# EAGLE design ArduinoProMiniLEDdriver (EAGLE 8.2.1)
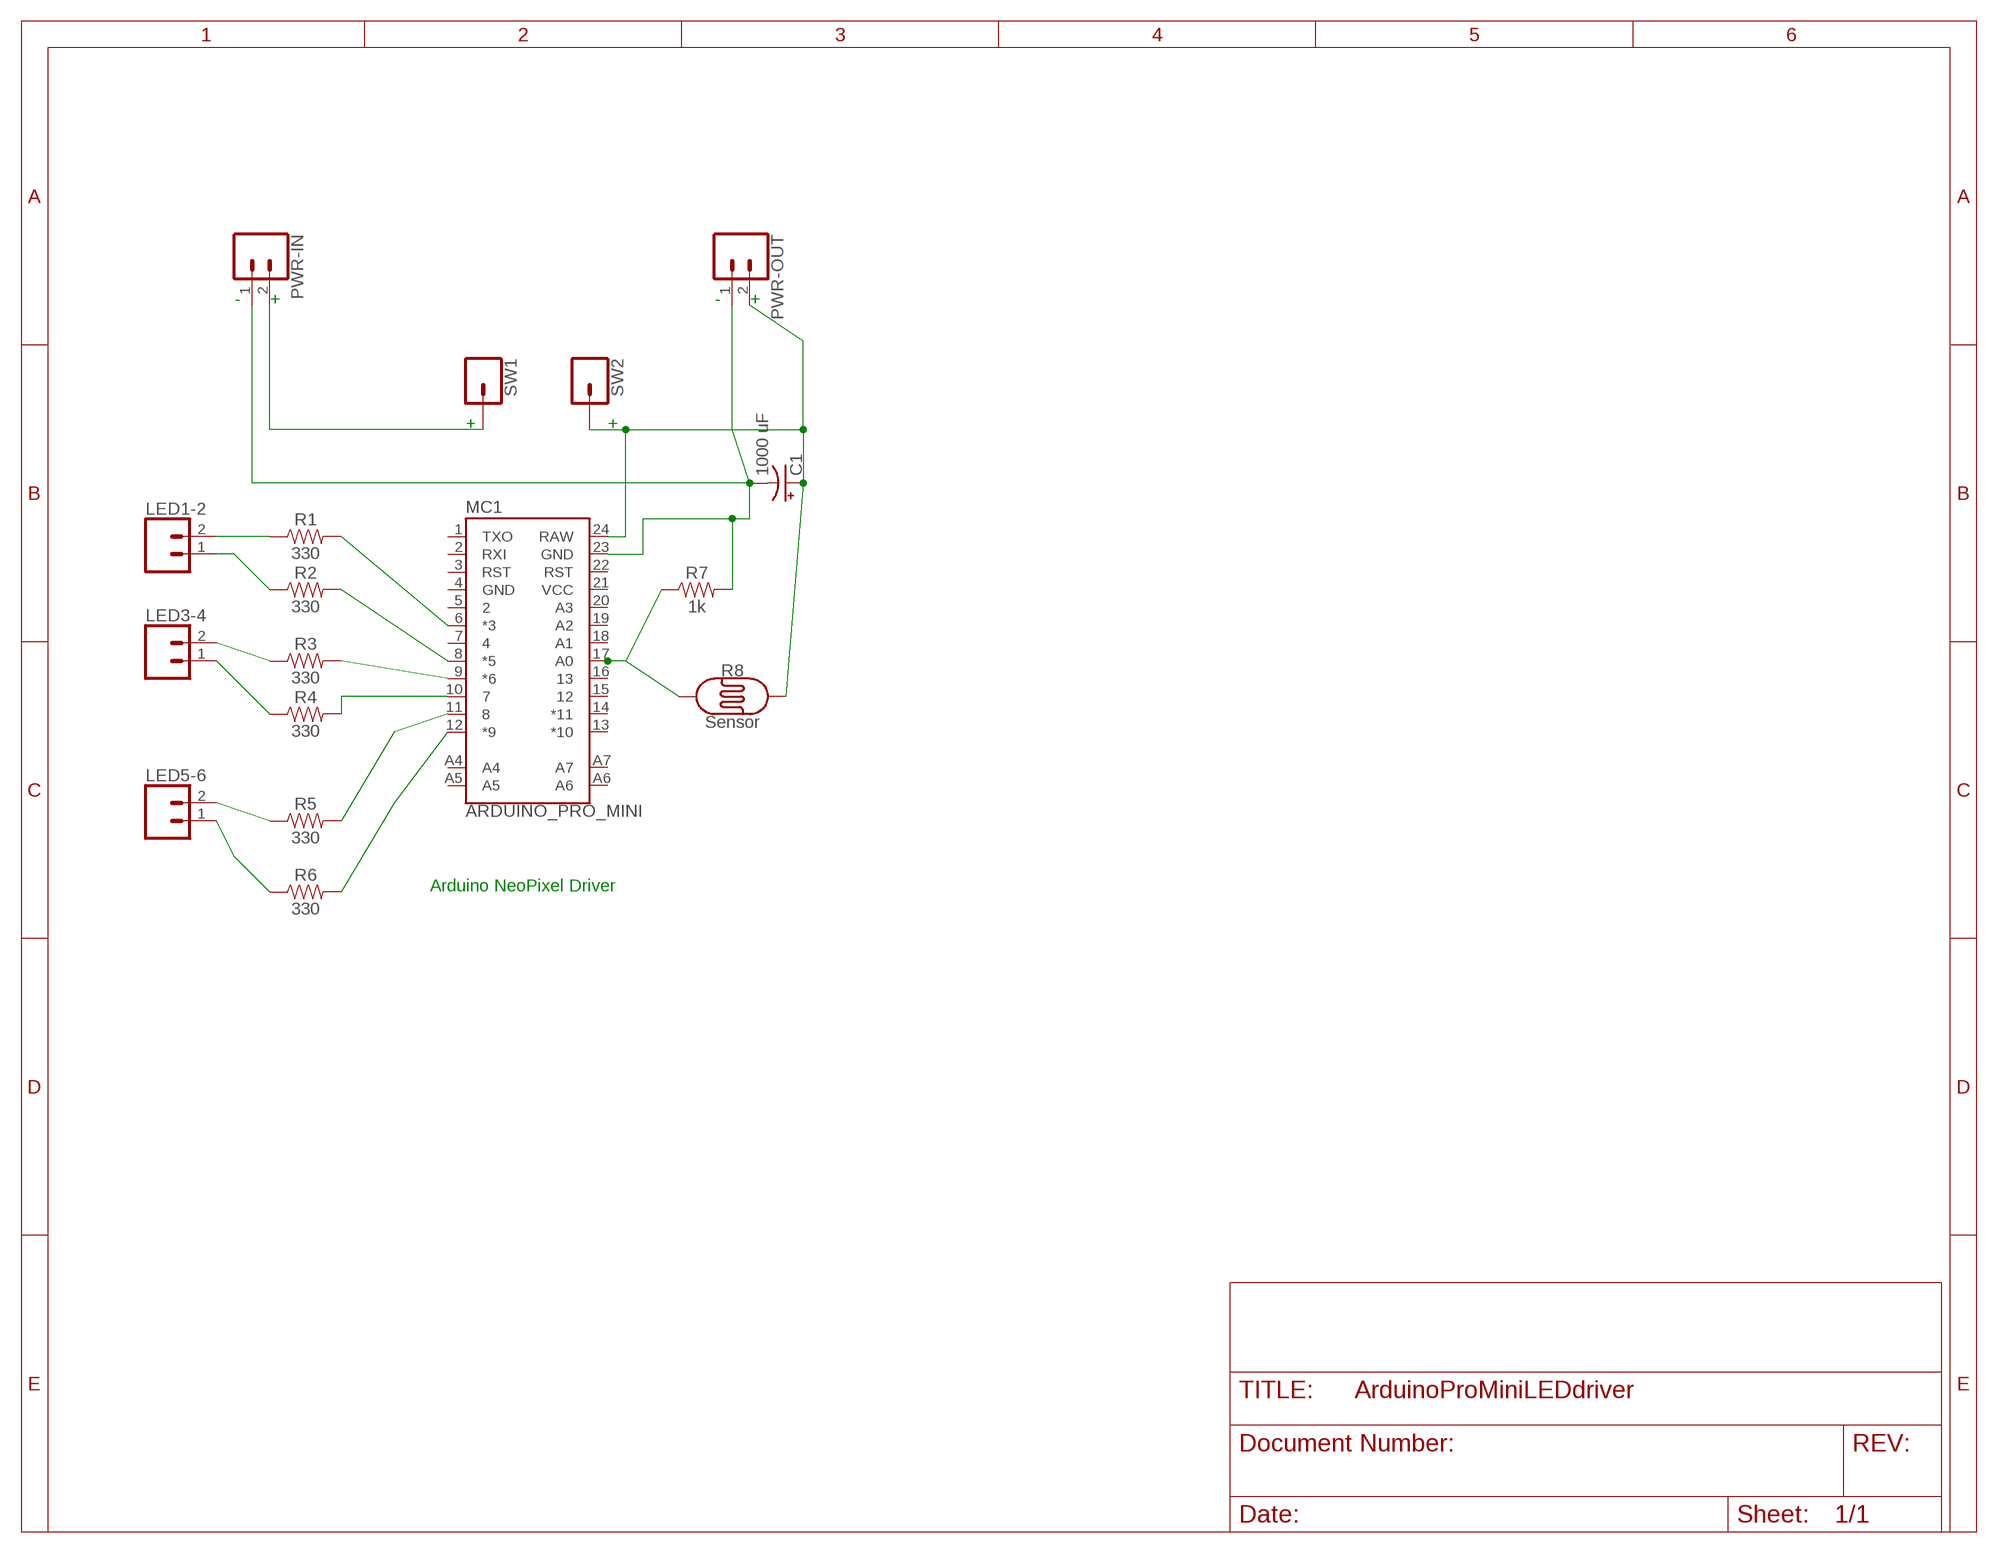
[diagram p0: schematic, sheet 1]

## Parts
C1  1000 uF  1000UF-RADIAL-5MM-25V-20%  [CPOL-RADIAL-5MM-10MM]
LED1-2  CONN_025MM  [SCREWTERMINAL-5MM-2]
LED3-4  CONN_025MM  [SCREWTERMINAL-5MM-2]
LED5-6  CONN_025MM  [SCREWTERMINAL-5MM-2]
MC1  ARDUINO_PRO_MINI  [ARDUINO_PRO_MINI]
PWR-IN  CONN_025MM  [SCREWTERMINAL-5MM-2]
PWR-OUT  CONN_025MM  [SCREWTERMINAL-5MM-2]
R1  330  330OHM-HORIZ-1/10W-5%  [AXIAL-0.3]
R2  330  330OHM-HORIZ-1/10W-5%  [AXIAL-0.3]
R3  330  330OHM-HORIZ-1/10W-5%  [AXIAL-0.3]
R4  330  330OHM-HORIZ-1/10W-5%  [AXIAL-0.3]
R5  330  330OHM-HORIZ-1/10W-5%  [AXIAL-0.3]
R6  330  330OHM-HORIZ-1/10W-5%  [AXIAL-0.3]
R7  1k  1KOHM-HORIZ-1/4W-1%  [AXIAL-0.3]
R8  Sensor  PHOTOCELLPTH  [PHOTOCELL]
SW1  CONN_01  [1X01]
SW2  CONN_01  [1X01]

## Nets
GND [Power]: C1.- MC1.23(GND) PWR-IN.1 PWR-OUT.1 R7.P$2
N$1: MC1.6(*3) R1.P$2
N$2: MC1.8(*5) R2.P$2
N$3: MC1.9(*6) R3.P$2
N$4: MC1.10 R4.P$2
N$5: LED1-2.2 R1.P$1
N$6: LED1-2.1 R2.P$1
N$7: LED3-4.2 R3.P$1
N$8: LED3-4.1 R4.P$1
N$9: LED5-6.2 R5.P$1
N$10: LED5-6.1 R6.P$1
N$11 [Power]: C1.+ MC1.24(RAW) PWR-OUT.2 R8.2 SW2.1
N$13 [Power]: PWR-IN.2 SW1.1
N$14: MC1.17(A0) R7.P$1 R8.1
N$15: MC1.11 R5.P$2
N$16: MC1.12(*9) R6.P$2
Unconnected: MC1.1(TXO) MC1.2(RXI) MC1.3(RST) MC1.5 MC1.7 MC1.13(*10) MC1.14(*11) MC1.15 MC1.16 MC1.18(A1) MC1.19(A2) MC1.20(A3) MC1.22(RST) MC1.A4 MC1.A5 MC1.A6 MC1.A7

## Notes on the sheet
- - | + | - | +
- + | +
- Arduino NeoPixel Driver

## Power pins joined to a net without a drawn wire
GND: MC1.4(GND)
VCC: MC1.21(VCC)

## Library data of the parts
C1 = SparkFun-Capacitors:1000UF: 1,000µF/1mF ceramic capacitors A capacitor is a passive two-terminal electrical component used to store electrical energy temporarily in an electric field. CAP-08070; PROD_ID: CAP-09538; VALUE: 1mF
LED1-2 LED3-4 LED5-6 PWR-IN PWR-OUT = SparkFun-Connectors:CONN_02: Multi connection point. Often used as Generic Header-pin footprint for 0.1 inch spaced/style header connections On any of the 0.1 inch spaced packages, you can populate with these: Break Away Headers - Straight <https://www.sparkfun.com/products/116> (PRT-00116) Break Away Male Headers - Right Angle <https://www.sparkfun.com/products/553> (PRT-00553) Female Headers <https://www.sparkfun.com/products/115> (PRT-00115) Break Away Headers - Machine Pin <https://www.sparkfun.com/products/117> (PRT-00117) Break Away Female Headers - Swiss Machine Pin <https://www.sparkfun.com/products/743> (PRT-00743) For SCREWTERMINALS and SPRING TERMINALS visit here: Screw Terimnals on SparkFun.com <https://www.sparkfun.com/search/results?term=Screw+Terminals> (5mm/3.5mm/2.54mm spacing) This device is also useful as a general connection point to wire up your design to another part of your project. Our various solder wires solder well into these plated through hole pads. Hook-Up Wire - Assortment (Stranded, 22 AWG) <https://www.sparkfun.com/products/11375> (PRT-11375) Hook-Up Wire - Assortment (Solid Core, 22 AWG) <https://www.sparkfun.com/products/11367> (PRT-11367) View the entire wire category on our website here <https://www.sparkfun.com/categories/141> Special notes: Molex polarized connector foot print use with: PRT-08233 with associated crimp pins and housings. 2.54_SCREWTERM for use with PRT-10571. 3.5mm Screw Terminal footprints for PRT-08084 5mm Screw Terminal footprints for use with PRT-08432; SF_SKU: PRT-08432
MC1 = SparkFun-Boards:ARDUINO_PRO_MINI: SparkFun Pro Mini Pro Mini compatible footprint. Dimensions: 0.7 x 1.3" PCB Thickness: 0.8mm SparkFun Products: 3.3V/8MHz <https://www.sparkfun.com/products/11114> 5V/16MHz <https://www.sparkfun.com/products/11113>
R1-R6 = SparkFun-Resistors:330OHM: 330Ω resistor A resistor is a passive two-terminal electrical component that implements electrical resistance as a circuit element. Resistors act to reduce current flow, and, at the same time, act to lower voltage levels within circuits. - Wikipedia; PROD_ID: RES-8371
R7 = SparkFun-Resistors:1KOHM: 1kΩ resistor A resistor is a passive two-terminal electrical component that implements electrical resistance as a circuit element. Resistors act to reduce current flow, and, at the same time, act to lower voltage levels within circuits. - Wikipedia; PROD_ID: RES-12182
R8 = SparkFun-Sensors:PHOTOCELL: Photocell (Photodetector, Photo Resistor, CdS) This is a very small light sensor. A photocell changes (also called a photodetector, photo resistor, CdS or photoconductive cell) resistance depending on the amount of light it is exposed to. These little sensors make great ambient light triggers (when light in the room turns on, do something). Datasheet <http://cdn.sparkfun.com/datasheets/Sensors/LightImaging/SEN-09088.pdf> SparkFun Products Mini Photocell <https://www.sparkfun.com/products/9088> (SEN-09088); PROD_ID: COMP-09129; SF_ID: SEN-09088
SW1 SW2 = SparkFun-Connectors:CONN_01: Single connection point. Often used as Generic Header-pin footprint for 0.1 inch spaced/style header connections On any of the 0.1 inch spaced packages, you can populate with these: Break Away Headers - Straight <https://www.sparkfun.com/products/116> (PRT-00116) Break Away Male Headers - Right Angle <https://www.sparkfun.com/products/553> (PRT-00553) Female Headers <https://www.sparkfun.com/products/115> (PRT-00115) Break Away Headers - Machine Pin <https://www.sparkfun.com/products/117> (PRT-00117) Break Away Female Headers - Swiss Machine Pin <https://www.sparkfun.com/products/743> (PRT-00743) This device is also useful as a general connection point to wire up your design to another part of your project. Our various solder wires solder well into these plated through hole pads. Hook-Up Wire - Assortment (Stranded, 22 AWG) <https://www.sparkfun.com/products/11375> (PRT-11375) Hook-Up Wire - Assortment (Solid Core, 22 AWG) <https://www.sparkfun.com/products/11367> (PRT-11367) View the entire wire category on our website here <https://www.sparkfun.com/categories/141> Special notes: SMTSO-256-ET is a "flush mount" nut for a 4-40 screw. We mostly use this on specialty testbeds; it is a nice way to connect hardware to your PCB at an adjustable hieght. Also note, the SNAP packages are for using a snappable style connector. We sell a baggie of snaps and they are also used on two LilyPad designs: Snap Assortment - 30 pack (male and female) <https://www.sparkfun.com/products/11347> (DEV-11347) LilyPad Arduino SimpleSnap <https://www.sparkfun.com/products/10941> (DEV-10941) LilyPad SimpleSnap Protoboard <https://www.sparkfun.com/products/10940> (DEV-10940)

## Net classes
1 Power: width 1.5 mm

## Board
An Arduino Pro Mini set up to drive up to 5 NeoPixel strands. An analog sensor input is also included.
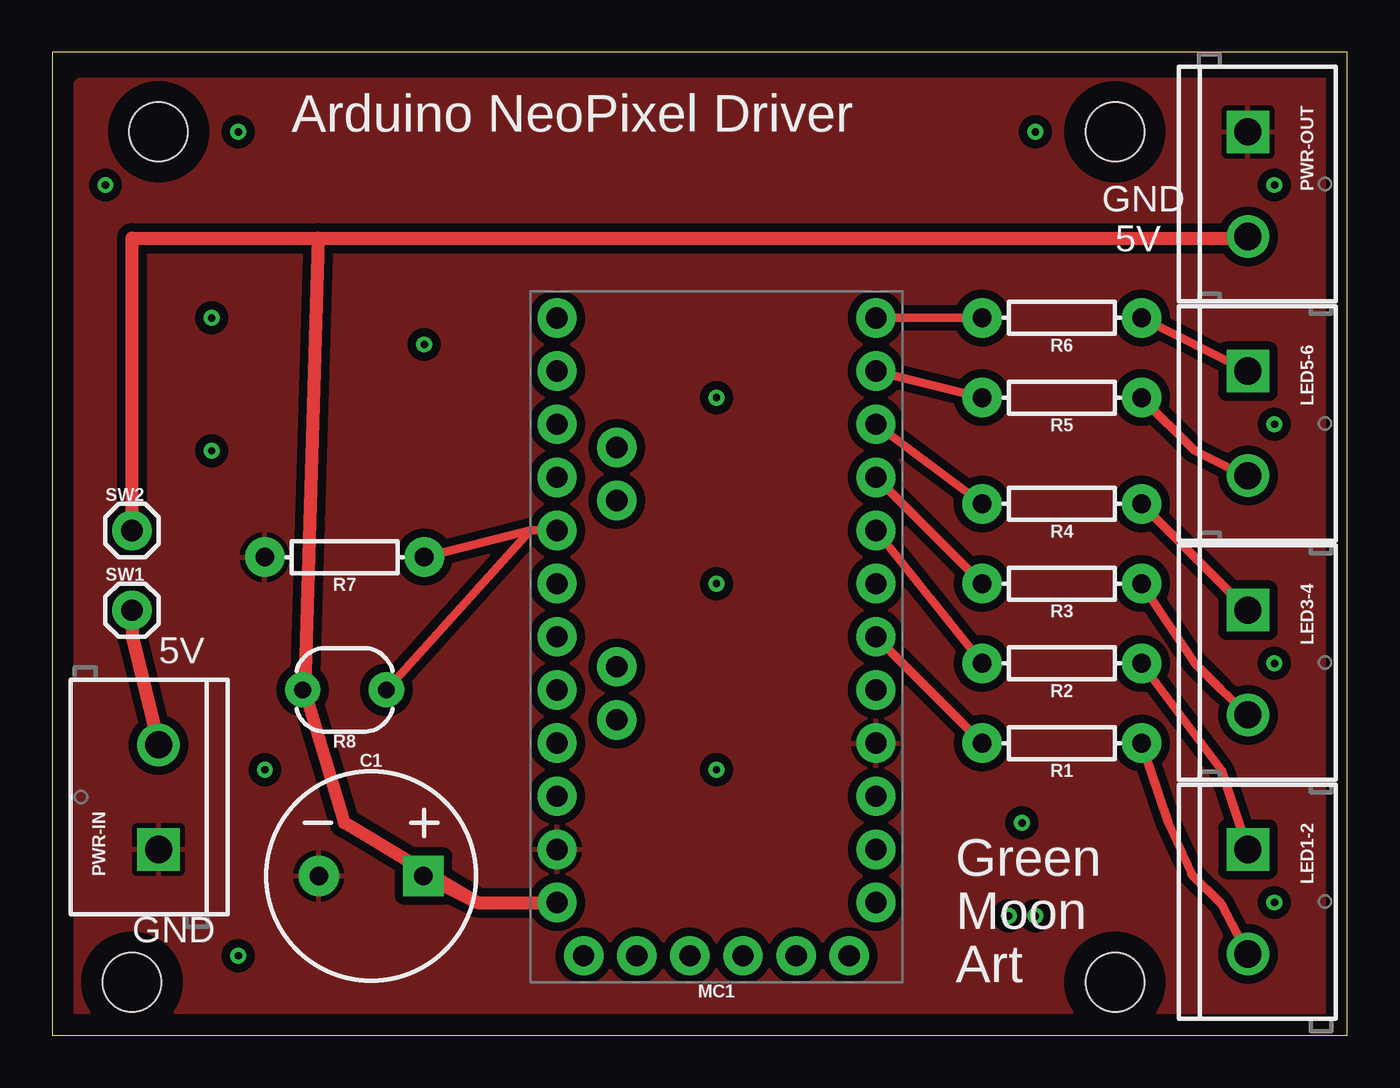
[diagram p1: board, top side]
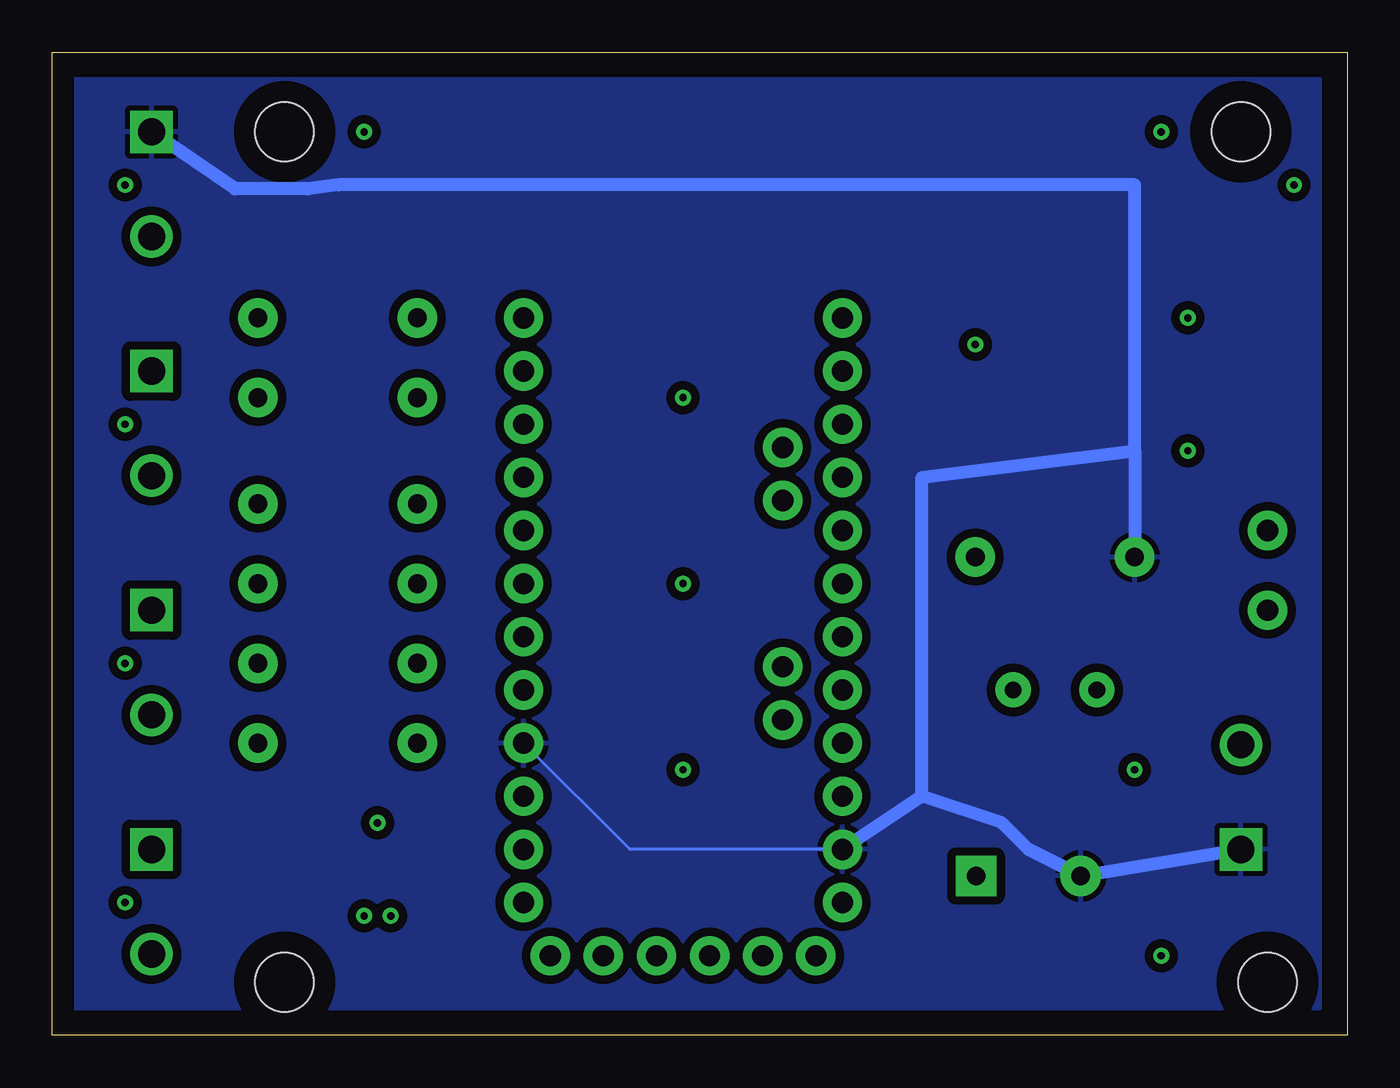
[diagram p2: board, bottom side, seen from below]

Size 61.9 x 46.98 mm. Coordinates in mm from the lower left corner, seen from the top.
Outline: 0,0 61.9,0 61.9,46.98 0,46.98 0,0
Copper layers (1*16): Top 0.035mm / dielectric 1.5mm / Bottom 0.035mm
Design rules "default": minimum track width 10mil, minimum drill 24mil, track to track 8mil, track to pad 8mil, pad to pad 8mil, via to via 8mil, smd to smd 8mil, copper to edge 40mil, drill to drill 8mil, minimum pad ring 10mil, minimum via ring 8mil, stop-mask expansion 4mil, vias tented up to drill 0mil, thermal gap 10mil
Holes 2.8 mm at 5.08,43.18 50.8,43.18 50.8,2.54 3.81,2.54

### Footprints (pad centres in the part's own frame; a part is rotated, then mirrored left to right if it is on the bottom)
CPOL-RADIAL-5MM-10MM = drill 0.9 pad 1.93 square: + 2.5,0 | drill 0.9 pad 1.93: - -2.5,0
SCREWTERMINAL-5MM-2 = drill 1.3 pad 2.032 square: 1 0,0 | drill 1.3 pad 2.032: 2 5,0
ARDUINO_PRO_MINI = drill 1.016 pad 1.88: 1 -7.62,12.7; 2 -7.62,10.16; 3 -7.62,7.62; 4 -7.62,5.08; 5 -7.62,2.54; 6 -7.62,0; 7 -7.62,-2.54; 8 -7.62,-5.08; 9 -7.62,-7.62; 10 -7.62,-10.16; 11 -7.62,-12.7; 12 -7.62,-15.24; 13 7.62,-15.24; 14 7.62,-12.7; 15 7.62,-10.16; 16 7.62,-7.62; 17 7.62,-5.08; 18 7.62,-2.54; 19 7.62,0; 20 7.62,2.54; 21 7.62,5.08; 22 7.62,7.62; 23 7.62,10.16; 24 7.62,12.7; A4 4.763,1.429; A5 4.763,3.969; A6 4.763,-9.049; A7 4.763,-6.509; BLK -6.35,15.24; GND -3.81,15.24; GRN 6.35,15.24; RXI 1.27,15.24; TXO 3.81,15.24; VCC -1.27,15.24
AXIAL-0.3 = drill 0.9 pad 1.88: P$1 -3.81,0; P$2 3.81,0
PHOTOCELL = drill 0.8 pad 1.676: 1 -2,0; 2 2,0
1X01 = drill 1.016 pad 1.88: 1 0,0

### Placement (x,y rotation side)
C1  15.24,7.62 0 top
LED1-2  57.15,8.89 270 top
LED3-4  57.15,20.32 270 top
LED5-6  57.15,31.75 270 top
MC1  31.75,19.05 180 top
PWR-IN  5.08,8.89 90 top
PWR-OUT  57.15,43.18 270 top
R1  48.26,13.97 180 top
R2  48.26,17.78 180 top
R3  48.26,21.59 180 top
R4  48.26,25.4 180 top
R5  48.26,30.48 180 top
R6  48.26,34.29 180 top
R7  13.97,22.86 180 top
R8  13.97,16.51 180 top
SW1  3.81,20.32 0 top
SW2  3.81,24.13 0 top

### Tracks (layer width: path | path; a pad name or v marks a point on that pad's centre or on a via)
GND
  Bottom 0.152: MC1.23 34.29,8.89 MC1.4
  Bottom 0.61: 10.16,27.94 10.16,40.64 48.22,40.64 49.67,40.46 53.16,40.46 PWR-OUT.1 | 10.16,27.94 20.32,26.67 20.32,11.43 | 20.32,11.43 MC1.23 | 10.16,27.94 R7.P$2 | 15.24,8.89 12.7,7.62 PWR-IN.1 | 20.32,11.43 16.51,10.16 15.24,8.89 | 15.24,8.89 C1.-
  pour Bottom (isolate 0.406): 1.27,45.72 60.96,45.72 60.96,1.27 1.27,1.27
  pour Top (isolate 0.406): 1.27,45.72 60.96,45.72 60.96,0 0,0 0,44.45
N$1
  Top 0.406: MC1.6 R1.P$2
N$2
  Top 0.406: MC1.8 R2.P$2
N$3
  Top 0.406: MC1.9 R3.P$2
N$4
  Top 0.406: MC1.10 R4.P$2
N$5
  Top 0.406: R1.P$1 53.34,10.16 54.46,7.77 54.46,7.71 55.88,6.28 LED1-2.2
N$6
  Top 0.406: R2.P$1 55.88,12.7 LED1-2.1
N$7
  Top 0.406: R3.P$1 54.61,17.78 55.88,16.51 LED3-4.2
N$8
  Top 0.406: R4.P$1 LED3-4.1
N$9
  Top 0.406: R5.P$1 54.61,27.94 57.15,26.67 LED5-6.2
N$10
  Top 0.406: R6.P$1 LED5-6.1
N$11
  Top 0.406: 57.15,38.1 PWR-OUT.2
  Top 0.61: 12.7,38.1 3.81,38.1 SW2.1 | 12.7,38.1 57.15,38.1 | 12.7,38.1 12.06,16.51 | 20.32,6.35 MC1.24 | 12.06,16.51 13.97,10.16 20.32,6.35 | 12.06,16.51 R8.2 | 20.32,6.35 C1.+
N$12  (via drill 0.35)
  other vias: 2.54,40.64
N$13
  Top 0.61: SW1.1 3.81,19.05 PWR-IN.2
N$14
  Top 0.406: 22.86,24.13 MC1.17 | 22.86,24.13 R8.1 | R7.P$1 22.86,24.13
N$15
  Top 0.406: MC1.11 R5.P$2
N$16
  Top 0.406: MC1.12 R6.P$2
N$17  (via drill 0.35)
  other vias: 7.62,34.29
N$19  (via drill 0.35)
  other vias: 7.62,27.94
N$20  (via drill 0.35)
  other vias: 10.16,12.7
N$21  (via drill 0.35)
  other vias: 8.89,3.81
N$22  (via drill 0.35)
  other vias: 31.75,30.48
N$23  (via drill 0.35)
  other vias: 31.75,21.59
N$24  (via drill 0.35)
  other vias: 31.75,12.7
N$25  (via drill 0.35)
  other vias: 17.78,33.02
N$26  (via drill 0.35)
  other vias: 46.99,43.18
N$27  (via drill 0.35)
  other vias: 8.89,43.18
N$28  (via drill 0.35)
  other vias: 58.42,40.64
N$29  (via drill 0.35)
  other vias: 58.42,29.21
N$30  (via drill 0.35)
  other vias: 58.42,17.78
N$31  (via drill 0.35)
  other vias: 58.42,6.35
N$32  (via drill 0.35)
  other vias: 46.99,5.71
N$33  (via drill 0.35)
  other vias: 45.72,5.71
N$34  (via drill 0.35)
  other vias: 46.35,10.16

### Text on the board
tPlace: Arduino NeoPixel Driver | GND | 5V | 5V | Green | Moon | GND | Art